# EAGLE design MGBC-LIPO_1-3 (EAGLE 9.6.2)
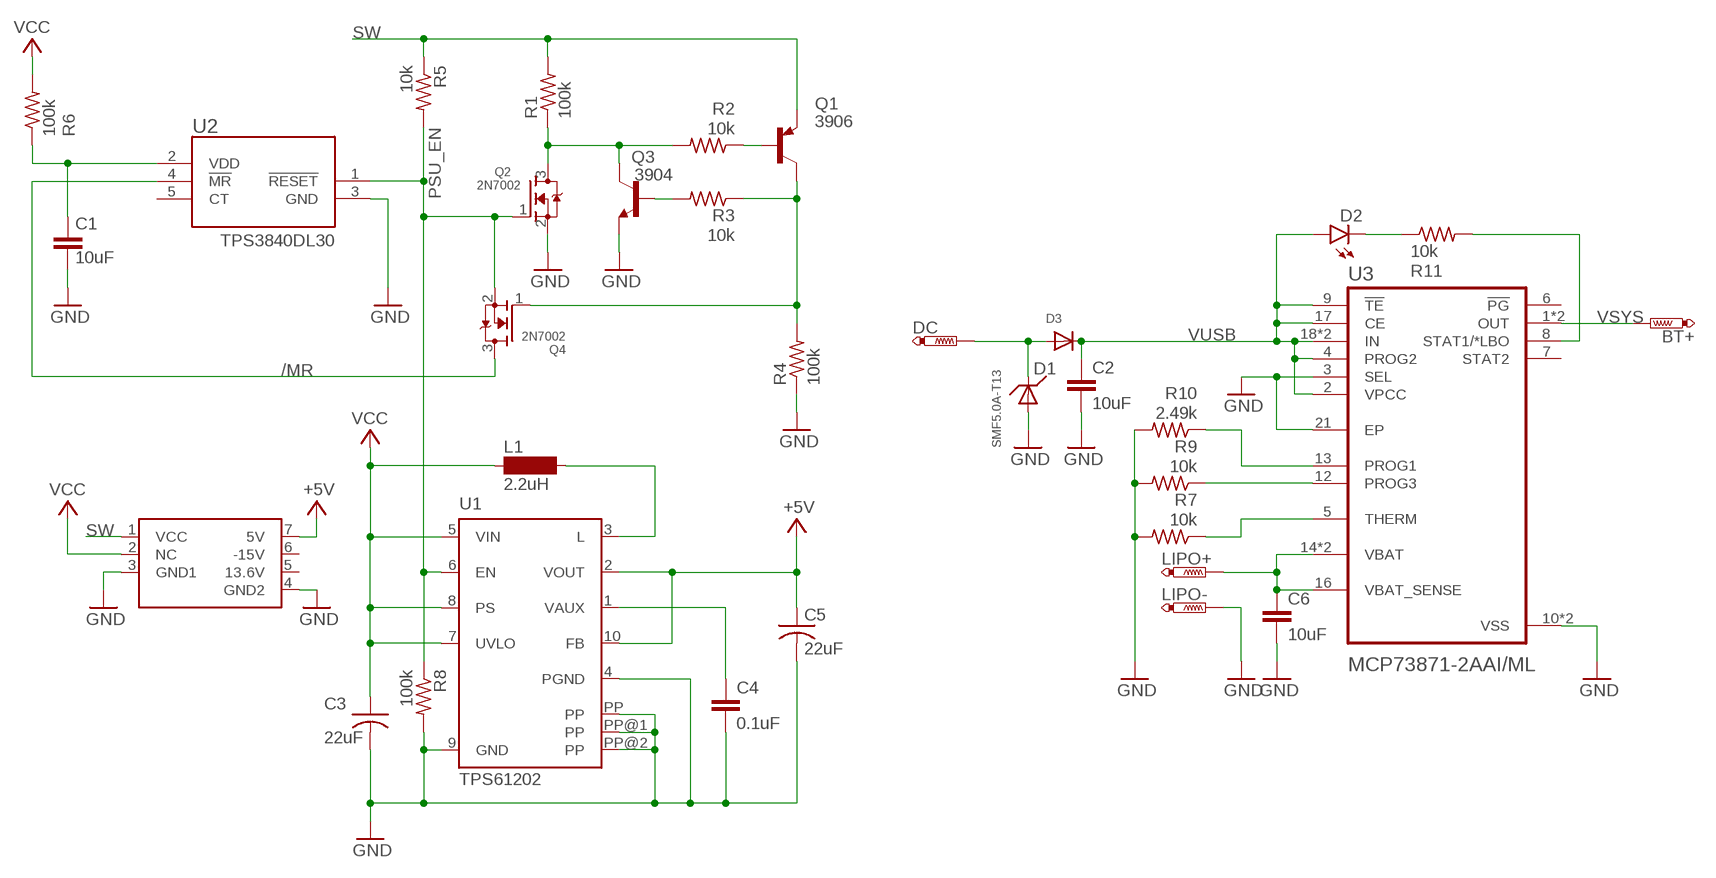
[diagram p0: schematic, sheet 1]

## Parts
BT+  PTR1SLIM  [P1-13S]
C1  10uF  C-EUC0805  [C0805]
C2  10uF  C-EUC0603  [C0603]
C3  22uF  C-USC0805  [C0805]
C4  0.1uF  C-EUC0603  [C0603]
C5  22uF  C-USC0805  [C0805]
C6  10uF  C-EUC0603  [C0603]
D1  SMF5.0A-T13  DIODESOD-123  [SOD-123]
D2  LEDSML0603  [SML0603]
D3  DIODESMA  [SMADIODE]
DC  PTR1SLIM  [P1-13S]
L1  2.2uH  LQH3NPN2R2  [1212]
LIPO+  PTR1SLIM  [P1-13S]
LIPO-  PTR1SLIM  [P1-13S]
Q1  MMBT3906LT1SMD  [SOT23-BEC]
Q2  2N7002  MOSFET-NREFLOW  [SOT23]
Q3  3904  MMBT3904LT1-NPN-SOT23-BEC  [SOT23-BEC]
Q4  2N7002  MOSFET-NREFLOW  [SOT23]
R1  100k  R-US_R0603  [R0603]
R2  10k  R-US_R0603  [R0603]
R3  10k  R-US_R0603  [R0603]
R4  100k  R-US_R0603  [R0603]
R5  10k  R-US_R0603  [R0603]
R6  100k  R-US_R0603  [R0603]
R7  10k  R-US_R0603  [R0603]
R8  100k  R-US_R0603  [R0603]
R9  10k  R-US_R0603  [R0603]
R10  2.49k  R-US_R0603  [R0603]
R11  10k  R-US_R0603  [R0603]
U1  TPS61202  [S-PDSO-N10]
U2  TPS3840  [SOT-23-5]
U3  MCP73871-2AAI/ML  [QFN50P400X400X100-21N]
U$1  MGB-PWR_BD  [MGB-PWRBD]

## Nets
+5V: C5.1 U1.2(VOUT) U1.10(FB) U$1.7(5V)
/MR: Q4.3(D) U2.4(!MR)
GND: C1.2 C2.2 C3.2 C4.2 C5.2 C6.2 D1.A LIPO-.TP Q2.2(S) Q3.E R4.1 R7.2 R8.2 R9.2 R10.2 U1.4(PGND) U1.9(GND) U1.PP U1.PP@1(PP) U1.PP@2(PP) U2.3(GND) U3.3(SEL) U3.10(VSS) U3.11(VSS) U3.21(EP) U$1.3(GND1) U$1.4(GND2)
L: L1.2 U1.3(L)
N$1: C1.1 R6.1 U2.2(VDD)
N$2: D1.C D3.A DC.TP
N$5: R11.2 U3.8(STAT1/*LBO)
N$6: R7.1 U3.5(THERM)
N$7: R10.1 U3.13(PROG1)
N$8: R9.1 U3.12(PROG3)
N$9: D2.C R11.1
N$10: Q1.B R2.1
N$12: Q1.C Q4.1(G) R3.1 R4.2
N$13: Q3.B R3.2
N$14: Q2.3(D) Q3.C R1.1 R2.2
N$34: C4.1 U1.1(VAUX)
PSU_EN: Q2.1(G) Q4.2(S) R5.2 R8.1 U1.6(EN) U2.1(!RESET)
SW: Q1.E R1.2 R5.1 U$1.1(VCC)
V_POS: C6.1 LIPO+.TP U3.14(VBAT) U3.15(VBAT) U3.16(VBAT_SENSE)
VCC: C3.1 L1.1 R6.2 U1.5(VIN) U1.7(UVLO) U1.8(PS) U$1.2(NC)
VSYS: BT+.TP U3.1(OUT) U3.20(OUT)
VUSB: C2.1 D2.A D3.C U3.2(VPCC) U3.4(PROG2) U3.9(!TE) U3.17(CE) U3.18(IN) U3.19(IN)
Unconnected: U2.5(CT) U3.6(!PG) U3.7(STAT2)

## Notes on the sheet
- 3906
- TPS3840DL30

## Power pins joined to a net without a drawn wire
13.6V: U$1.5(13.6V)
-15V: U$1.6(-15V)

## Library data of the parts
BT+ DC LIPO+ LIPO- = testpad:PTR1: TEST PIN
C1 C2 C4 C6 = rcl:C-EU: CAPACITOR, European symbol; SPICEPREFIX: C
C3 C5 = rcl:C-US: CAPACITOR, American symbol; SPICEPREFIX: C
D1 D3 = adafruit:DIODE: Diode SMADIODE - SMA Surface Mount Package 20V 1A Schottky Diode Digikey: 641-1014-6-ND DO-1N4148 - Through Hole Small Current Diode SOD-123 20V 1 A (.5mV Vf) Schottky Diode - Digikey: MBRX120TPMSCT-ND SOD-323 10V 570mA (.38mV Vf, 3ns) Schottky Diode - Digikey: ZLLS410CT-ND SOD-523 30V 30mA Schottky Diode (RB751S-40TE61) - Digikey: RB751S-40TE61CT-ND SOT23-R/W - SOT23 Package (R = Solder Paste/Reflow Ovens, W = Hand-Soldering) BAT54Film 40V 300mA - Digikey: 497-7162-1-ND
D2 = led:LED: LED OSRAM: - CHIPLED LG R971, LG N971, LY N971, LG Q971, LY Q971, LO R971, LY R971 LH N974, LH R974 LS Q976, LO Q976, LY Q976 LO Q996 - Hyper CHIPLED LW Q18S LB Q993, LB Q99A, LB R99A - SideLED LS A670, LO A670, LY A670, LG A670, LP A670 LB A673, LV A673, LT A673, LW A673 LH A674 LY A675 LS A676, LA A676, LO A676, LY A676, LW A676 LS A679, LY A679, LG A679 - Hyper Micro SIDELED® LS Y876, LA Y876, LO Y876, LY Y876 LT Y87S - SmartLED LW L88C, LW L88S LB L89C, LB L89S, LG L890 LS L89K, LO L89K, LY L89K LS L896, LA L896, LO L896, LY L896 - TOPLED LS T670, LO T670, LY T670, LG T670, LP T670 LSG T670, LSP T670, LSY T670, LOP T670, LYG T670 LG T671, LOG T671, LSG T671 LB T673, LV T673, LT T673, LW T673 LH T674 LS T676, LA T676, LO T676, LY T676, LB T676, LH T676, LSB T676, LW T676 LB T67C, LV T67C, LT T67C, LS T67K, LO T67K, LY T67K, LW E67C LS E67B, LA E67B, LO E67B, LY E67B, LB E67C, LV E67C, LT E67C LW T67C LS T679, LY T679, LG T679 LS T770, LO T770, LY T770, LG T770, LP T770 LB T773, LV T773, LT T773, LW T773 LH T774 LS E675, LA E675, LY E675, LS T675 LS T776, LA T776, LO T776, LY T776, LB T776 LHGB T686 LT T68C, LB T68C - Hyper Mini TOPLED® LB M676 - Mini TOPLED Santana® LG M470 LS M47K, LO M47K, LY M47K Source: http://www.osram.convergy.de LUXEON: - LUMILED® LXK2-PW12-R00, LXK2-PW12-S00, LXK2-PW14-U00, LXK2-PW14-V00 LXK2-PM12-R00, LXK2-PM12-S00, LXK2-PM14-U00 LXK2-PE12-Q00, LXK2-PE12-R00, LXK2-PE12-S00, LXK2-PE14-T00, LXK2-PE14-U00 LXK2-PB12-K00, LXK2-PB12-L00, LXK2-PB12-M00, LXK2-PB14-N00, LXK2-PB14-P00, LXK2-PB14-Q00 LXK2-PR12-L00, LXK2-PR12-M00, LXK2-PR14-Q00, LXK2-PR14-R00 LXK2-PD12-Q00, LXK2-PD12-R00, LXK2-PD12-S00 LXK2-PH12-R00, LXK2-PH12-S00 LXK2-PL12-P00, LXK2-PL12-Q00, LXK2-PL12-R00 Source: www.luxeon.com KINGBRIGHT: KA-3528ASYC Source: www.kingbright.com
L1 = gameboy:LQH3NPN2R2: INDUCTOR SMD power inductor; OC_FARNELL: unknown; OC_NEWARK: unknown
Q1 = transistor-pnp:MMBT3906*: PNP Transistror
Q2 Q4 = adafruit:MOSFET-N: N-Channel Mosfet 2N7002E - 60V 260mA SOT23 [Digikey: 2N7002ET1GOSTR-ND] - REEL BSH103 - 30V 850mA SOT23 [Digikey: 568-5013-1-ND]
Q3 = transistor-neu-to92:*-NPN-: NPN Transistror
R1-R11 = rcl:R-US_: RESISTOR, American symbol; SPICEPREFIX: R
U1 = texas:TPS6120*: LOW INPUT VOLTAGE SYNCHRONOUS BOOST CONVERTER WITH 1.3-A SWITCHES Source: http://focus.ti.com/lit/ds/symlink/tps61200.pdf; MPN: TPS61202DRCR; OC_FARNELL: unknown; OC_NEWARK: 37M0069
U2 = SOT95P280X145-5N:TPS3840
U3 = MCP73871-2AAI_ML:MCP73871-2AAI/ML; DESCRIPTION: Charger IC Lithium Ion/Polymer 20-QFN (4x4); DIGI-KEY_PART_NUMBER: MCP73871-2AAI/ML-ND; MF: Microchip Technology; MP: MCP73871-2AAI/ML; PACKAGE: QFN-20 Microchip Technology; PURCHASE-URL: https://pricing.snapeda.com/search/part/MCP73871-2AAI/ML/?ref=eda
U$1 = Game Boy:MGB-PWR_BD

## Board
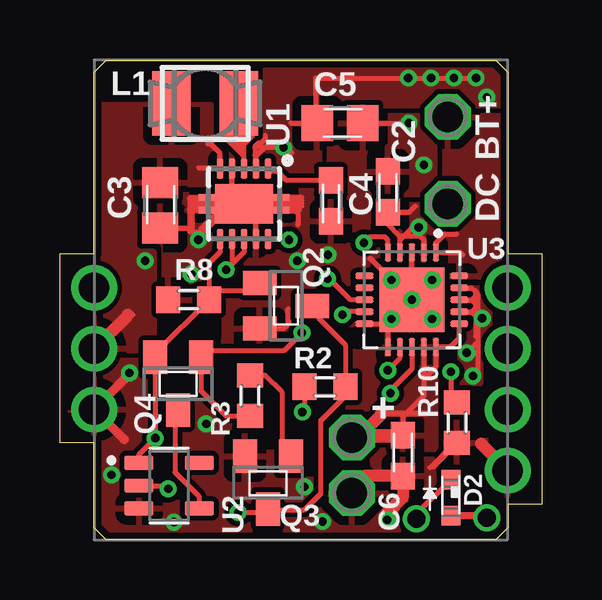
[diagram p1: board, top side]
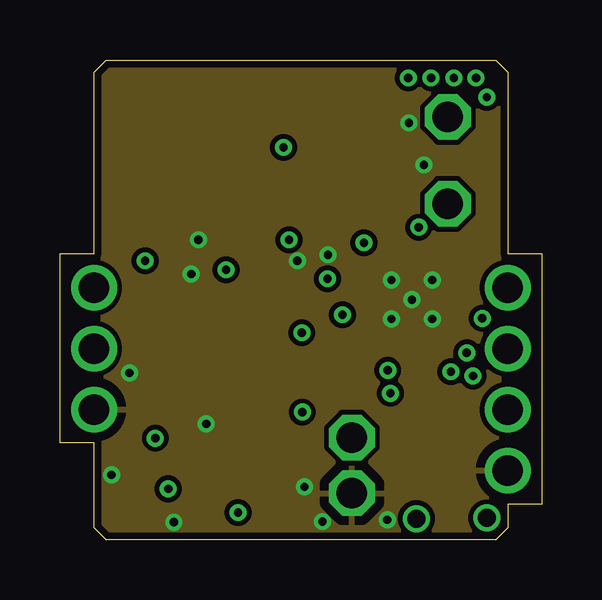
[diagram p2: board, inner layer Route2]
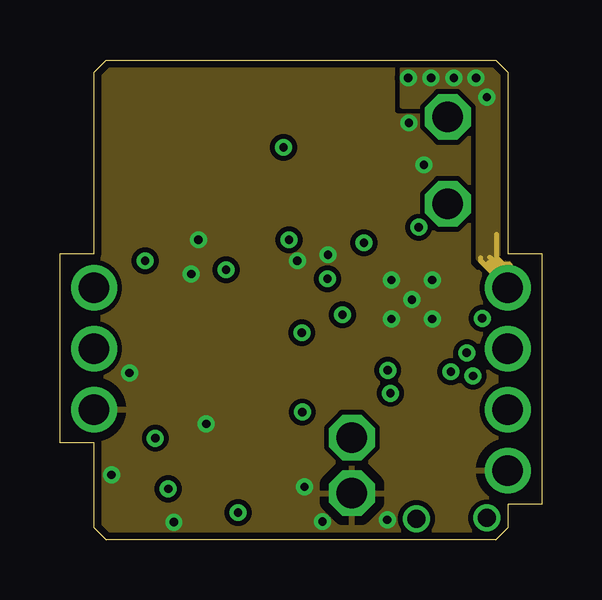
[diagram p3: board, inner layer Route15]
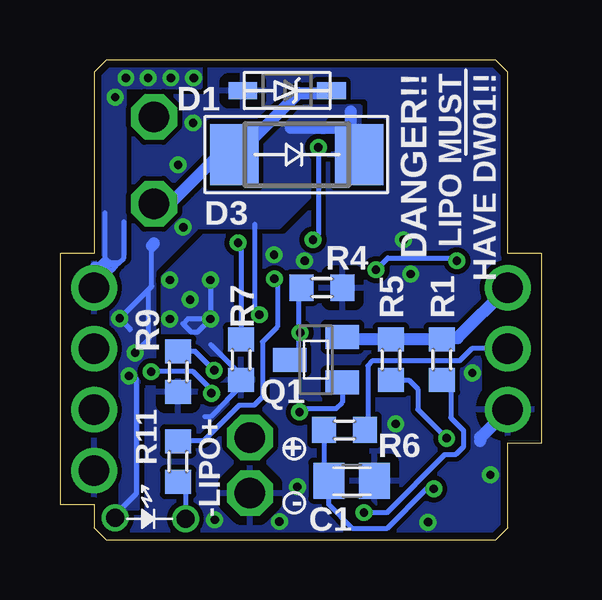
[diagram p4: board, bottom side, seen from below]

Size 20.1 x 20 mm. Coordinates in mm from the lower left corner, seen from the top.
Outline: 1.43,0.5 1.43,4.04 0,4.04 0,11.93 1.43,11.93 1.43,19.5 1.93,20 18.18,20 18.68,19.5 18.68,11.93 20.1,11.93 20.1,1.48 18.68,1.48 18.68,0.5 18.18,0 1.93,0 1.43,0.5
Copper layers (1+2*15+16): Top 0.0356mm / dielectric 1.5011mm / Route2 0.0356mm / dielectric 0.1499mm / Route15 0.0356mm / dielectric 0.2007mm / Bottom 0.0356mm
Design rules "jlcpcb *": minimum track width 8mil, minimum drill 13mil, track to track 8mil, track to pad 8mil, pad to pad 8mil, via to via 8mil, smd to smd 5mil, copper to edge 12mil, drill to drill 22mil, minimum pad ring 7mil, minimum via ring 7mil, stop-mask expansion 2.5mil, vias tented up to drill 14mil, thermal gap 15mil
tRestrict: area 0.1,5.8 to 1.1,9.8; area 19.3,2.8 to 20.6,10.3; area 12.4,8.2 to 13.2,8.6; area 18.2,4.1 to 18.7,5.1; area 17.3,4.5 to 18.3,5.1; area 16.9,1.9 to 17.9,2.8; area 10.3,2.9 to 10.6,3.9; area 8.7,4 to 8.9,5; area 4.4,8.8 to 4.5,9.2; area 6.3,8.4 to 6.4,9.1; area 13.3,9.6 to 13.5,10.4; area 15.9,9.6 to 16.1,10.4; 1 more areas
bRestrict: area 0.7,6 to 2.2,8; area 19.3,2.8 to 20.6,10.3; area 7.5,3.5 to 7.9,4

### Footprints (pad centres in the part's own frame; a part is rotated, then mirrored left to right if it is on the bottom)
P1-13S = drill 1.27 pad 1.905 octagon: TP 0,0
C0805 = smd 1.3 x 1.5: 1 -0.95,0; 2 0.95,0
C0603 = smd 1.1 x 1: 1 -0.85,0; 2 0.85,0
SOD-123 = smd 1.2 x 0.7: A 1.85,0; C -1.85,0
SML0603 = smd 0.8 x 0.8: A 0.75,0; C -0.75,0
SMADIODE = smd 2.032 x 2.54: A 2.603,0; C -2.603,0
1212 = smd 1.6 x 2.7: 1 1.4,0; 2 -1.4,0
SOT23-BEC = smd 1 x 1.4: B -0.95,-1.1; C 0,1.1; E 0.95,-1.1
SOT23 = smd 1 x 1.4: 1 -0.95,-1.1; 2 0.95,-1.1; 3 0,1.1
R0603 = smd 1 x 1.1: 1 -0.85,0; 2 0.85,0
S-PDSO-N10 = smd 0.28 x 0.85: 1 -1,-1.475; 2 -0.5,-1.475; 3 0,-1.475; 4 0.5,-1.475; 5 1,-1.475; 6 1,1.475; 7 0.5,1.475; 8 0,1.475; 9 -0.5,1.475; 10 -1,1.475 | smd 2.4 x 1.65: PP 0,0 | smd 3.8 x 0.28: PP@1 0,0.275; PP@2 0,-0.275
SOT-23-5 = smd 1.21 x 0.59: 1 -1.255,0.95; 2 -1.255,0; 3 -1.255,-0.95; 4 1.255,-0.95; 5 1.255,0.95
QFN50P400X400X100-21N = smd 0.76 x 0.26: 1 -1.975,1; 2 -1.975,0.5; 3 -1.975,0; 4 -1.975,-0.5; 5 -1.975,-1; 11 1.975,-1; 12 1.975,-0.5; 13 1.975,0; 14 1.975,0.5; 15 1.975,1 | smd 0.26 x 0.76: 6 -1,-1.975; 7 -0.5,-1.975; 8 0,-1.975; 9 0.5,-1.975; 10 1,-1.975; 16 1,1.975; 17 0.5,1.975; 18 0,1.975; 19 -0.5,1.975; 20 -1,1.975 | smd 2.7 x 2.7: 21 0,0
MGB-PWRBD = drill 1.27: 1 -0.25,10.5; 2 -0.25,7.96; 3 -0.25,5.42; 4 17,2.88; 5 17,5.42; 6 17,7.96; 7 17,10.5

### Placement (x,y rotation side)
BT+  16.18,17.62 0 top
C1  7.94,2.45 0 bottom
C2  13.68,14.5 90 top
C3  4.17,13.94 270 top
C4  11.3,14.12 270 top
C5  11.68,17.38 0 top
C6  14.3,3.5 270 top
D1  10.62,18.73 180 bottom
D2  16.3,1.75 270 top
D3  10.23,16.05 180 bottom
DC  16.18,14 0 top
L1  6.05,18.19 180 top
LIPO+  12.18,4.25 0 top
LIPO-  12.18,1.94 180 top
Q1  9.43,7.5 90 bottom
Q2  9.43,9.75 270 top
Q3  8.68,2.38 180 top
Q4  4.92,6.5 180 top
R1  4.17,7.5 90 bottom
R2  11.05,6.38 0 top
R3  7.92,6 90 top
R4  9.18,10.5 180 bottom
R5  6.3,7.5 270 bottom
R6  10k  [R0603]  8.24,4.58 0 bottom
R7  12.55,7.5 270 bottom
R8  5.36,10 180 top
R9  15.18,7 270 bottom
R10  16.55,4.88 270 top
R11  15.18,3.25 90 bottom
U1  7.67,14 180 top
U2  4.55,2.25 0 top
U3  14.68,10 270 top
U$1  1.68,0 0 top

### Tracks (layer width: path | path; a pad name or v marks a point on that pad's centre or on a via)
+5V  (via drill 0.35)
  Top 0.203: 9.62,17.38 C5.1 10.68,17.43 10.68,19.25 v17.35,19.25 | U1.2 8.18,16 | 8.18,16 8.55,16.38 8.68,16.38 | 8.18,16 8.12,16.05 8.12,16.38 8.28,16.53 8.38,16.53 | 8.55,16.85 8.55,16.71 8.38,16.53 | 8.38,16.53 8.36,16.52 8.36,16.36 v9.33,16.36 9.45,16.36 9.68,16.12 | U1.10 9.53,12.53 v9.55,12.5
  Route15 0.203: U$1.7 17.55,11.62 17.55,11.75 | 18.22,12.72 18.22,11.74 18.49,11.47 18.78,11.47 18.78,11.03 18.73,10.97 | U$1.7 18.68,10.93 18.73,10.97 | U$1.7 18.68,10.75 17.88,11.55 | 18.73,10.97 17.93,11.78
  Bottom 0.203: v9.33,16.36 9.33,12.72 v9.55,12.5 | 18.06,11.12 17.85,11.32 | 17.85,11.32 17.65,11.53 | 17.65,11.53 17.43,11.75 17.43,13.25 | 18.61,10.56 18.22,10.96 | 18.22,10.96 18.22,11.3 | 18.22,11.3 18.22,11.72 | 18.22,11.72 18.22,11.75 | 18.22,11.75 18.22,13.62 | 18.22,11.75 17.99,11.53 | 17.65,11.53 17.99,11.53 | 18.06,11.46 17.99,11.53 | 18.06,11.46 18.22,11.3 | U$1.7 18.61,10.56 | 18.22,10.96 18.06,11.12 | 18.06,11.12 18.06,11.46 | 17.99,11.53 17.85,11.38 17.85,11.32 | 18.22,11.72 18.41,11.53 18.41,11.46 | 18.38,11.33 18.51,11.21 | 18.61,10.56 18.61,11.23 18.51,11.33 18.51,11.21 | U$1.7 18.51,10.67 18.51,11.21 | U$1.7 18.38,10.79 18.38,11.33 | 18.38,11.33 18.38,11.46 18.41,11.46 | 18.41,11.46 18.42,11.47 18.73,11.47
  other vias: 16.43,19.25 15.48,19.25 17.8,18.45 14.53,19.25
  pour Top (isolate 0.203, rank 2): 7.67,15.12 7.67,20 20.18,20 20.18,18.07 10.83,18.07 10.83,15.38 8.43,15.38 8.18,15.12
  pour Bottom (isolate 0.203, rank 2): 17.43,9.5 20.43,9.5 20.43,20.25 14.25,20.25 14.25,18.88 17.43,18.88
  pour Route15 (isolate 0.203, rank 2): 14.25,19.57 14.25,18.07 17.4,18.07 17.43,18.05 17.43,17.6 17.43,14.57 17.43,11.75 18.68,10.5 18.95,10.5 18.95,20.23 18.93,20.25 14.9,20.25 14.25,19.6
/MR
  Top 0.203: Q4.3 4.8,5.28 4.8,2.81 5.8,1.8 U2.4
GND  (via drill 0.35)
  Top 0.203: U1.4 7.17,14.12 7.02,13.97 | U1.9 8.18,13.88 | U3.10 14.08,9 | 14.08,9 14.3,9 | 7.05,14 6.92,14.12 | 5.4,13.75 5.4,14.22 5.42,14.25 7.42,14.25 7.55,14.12 6.92,14.12 | 5.4,13.75 5.4,13 | 5.4,13 5.4,12.85 6,12.85 | 5.4,13.75 5.53,13.75 | 5.53,13.75 6.8,13.75 7.02,13.97 | C3.2 5.39,12.99 5.4,13 | 6,12.85 6.02,12.85 | 7.02,13.85 7.02,13.97 | U1.PP@1 6.88,13.72 6,12.85 | 6.92,14.12 5.55,14.12 | 5.55,13.88 7.55,13.88 U1.PP | 6.75,13.85 5.88,12.97 | 5.53,13 5.53,13.75 | 7.05,14 7.33,14.28 10.08,14.28 | 7.05,14 7.33,13.72 9.8,13.72 | 9.8,13.72 9.98,13.72 | 7.95,14.15 10.08,14.15 | 7.95,13.9 10.08,13.9 | 9.8,13.72 9.93,13.6 9.93,13.12 | R10.2 16.45,4.03 15.43,3 | 17.55,4 | 15.58,3.02 16.6,4.05 | C5.2 v14.55,17.38 | Q2.2 9.33,8.8 9.54,9.01 9.54,9.1 9.52,9.12 9.52,9.62 | 2.67,6.67 2.67,7 | 2.67,4.17 2.67,4.12 | U3.21 U3.3 | U3.21 14.65,10 v13.83,10.82 | U3.11 13.68,9.3 13.98,9.3 U3.21 | 10.08,14.03 7.7,14.03 U1.PP | U1.PP 5.55,14 5.53,13.97 5.53,13.75 | U3.21 14.08,9.4 14.08,9 | U3.21 12.96,11.72 12.93,11.72
  Top 0.4: 2.67,6.67 U$1.3 2.67,4.17
  Top 0.5: U$1.4 17.55,4 | LIPO-.TP 12.18,2.15 12.68,2.65 C6.2 14.3,1.77 13.65,1.12 v13.65,0.82
  Bottom 0.203: 14.05,5.12 13.82,5.12 13.12,5.83 12.55,6.4 R7.2 12.44,6.76 13.68,8 | 13.68,8 13.8,8.12 13.68,8 | v13.83,9.2 14.78,9.2 14.98,9 14.63,8.65 14.37,8.65 v13.83,9.2 | v13.83,10.82 v13.83,9.2
  Bottom 0.5: U$1.3 2.58,4.27 2.58,4.1
  other vias: 15.18,15.62 11.18,11.88 9.9,11.62 5.77,12.5 5.47,11.07 6.1,4.83 4.75,0.72 2.15,2.7 10.2,2.2 10.95,0.75 15.53,10.82 15.53,9.2 2.9,6.95 14.68,10.01
  pour Top (isolate 0.203, rank 6): -0.57,20.88 21.43,20.88 21.43,-1.12 -1.2,-1.12 -1.2,20.25
  pour Bottom (isolate 0.203, rank 6): -1.2,20.5 21.05,20.5 21.05,-0.25 -1.2,-0.25
  pour Route2 (isolate 0.203, rank 6): 1.8,21 18.3,21 18.3,-1.12 1.8,-1.12
  pour Route15 (isolate 0.203, rank 6): 1.8,21.12 18.18,21.12 18.18,-0.88 1.8,-0.88
L
  Top 0.203: U1.3 7.67,16 | 7.67,16 7.67,16.25 | 7.67,16.25 7.05,16.88 6.92,16.88 | 7.67,16.25 7.67,16.62 | 7.67,16.62 7.61,16.56 | 7.99,16.81 7.67,16.5 7.61,16.56 | 7.99,16.81 8.05,16.88 8.05,17.12 7.92,17.25 | 7.67,16 6.92,16.75 | L1.2 7.45,17.4 6.92,16.88 | L1.2 7.33,18.06 7.33,17 | 7.33,17 7.33,16.85 7.61,16.56 | 7.67,16.62 7.8,16.75 | 7.8,16.75 7.86,16.81 7.99,16.81 | 7.67,16.62 7.67,16.65 7.33,17 | L1.2 7.45,17.1 7.8,16.75 | 6.92,16.75 6.92,16.88 | 6.92,16.75 6.77,16.9 6.77,17.3
N$1  (via drill 0.35)
  Top 0.203: U2.2 4.38,2.25 v4.51,2.11
  Bottom 0.203: v4.51,2.11 4.81,2.11 6.47,0.46 7.88,0.46 8.89,1.46 C1.1 9.09,2.46 R6.1
N$2
  Bottom 0.5: DC.TP 15.53,14 13.48,16.05 D3.A 12.23,16.05 12.48,16.3 | 13.12,16.95 12.48,16.3 | D1.C 8.88,18.62 10.15,18.62 12.48,16.3
N$5  (via drill 0.35)
  Top 0.203: U3.8 12.12,10 11.24,10.88 v11.16,10.88
  Bottom 0.203: R11.2 15.15,4.12 14.1,4.12 12.63,5.59 12,5.59 11.66,5.94 11.66,8.25 11.03,8.88 11.03,10.75 v11.16,10.88
N$6  (via drill 0.35)
  Top 0.203: U3.5 13.68,12.5 13.55,12.62 12.93,12.62 v12.68,12.38
  Bottom 0.203: v12.68,12.38 12.55,12.25 R7.1
N$7  (via drill 0.35)
  Top 0.203: v16.3,7 16.3,5.97 R10.1 | U3.13 14.68,7.12 13.78,6.22 v13.78,6.1
  Bottom 0.203: v16.3,7 16.27,7.03 14.57,7.03 13.78,6.24 v13.78,6.1 13.78,6.22
N$8  (via drill 0.35)
  Top 0.203: U3.12 14.18,7.56 v13.67,7.06
  Bottom 0.203: v13.67,7.06 14.46,7.85 R9.1
N$9  (via drill 0.75)
  Top 0.203: v14.87,0.88 14.87,1.07 D2.C
  Bottom 0.203: R11.1 14.87,2.09 v14.87,0.88
N$10  (via drill 0.35)
  Top 0.203: R2.1 10.2,5.41 v10.11,5.31
  Bottom 0.203: Q1.B 8.33,5.72 8.58,5.46 9.96,5.46 v10.11,5.31
N$12  (via drill 0.35)
  Top 0.203: R3.1 6.92,5.15 5.88,6.2 Q4.1 6.15,7.88 9.34,7.88 v10.09,8.62
  Bottom 0.203: R4.2 10.15,10.38 10.15,8.62 | Q1.C 10.15,7.88 10.15,8.62 | v10.09,8.62 10.15,8.62
N$13
  Top 0.203: R3.2 8.55,6.85 9.25,6.15 9.25,3.48 Q3.B
N$14  (via drill 0.35)
  Top 0.203: Q2.3 10.8,9.47 10.8,9.22 11.9,8.12 R2.2 11.9,6 10.88,4.97 10.88,1.93 10.2,1.25 8.7,1.25 Q3.C 8.53,1.12 v7.42,1.12
  Bottom 0.203: R1.1 3.8,6.28 3.8,5.08 3.28,4.55 3.28,3.88 3.6,3.55 4.05,3.55 6.47,1.12 v7.42,1.12
N$34
  Top 0.203: U1.1 8.8,15.35 9.08,15.35 9.45,14.97 C4.1
PSU_EN  (via drill 0.35)
  Top 0.203: Q2.1 8,10.38 6.59,10.38 R8.1 | R8.1 3.97,7.76 Q4.2 v3.97,4.22 3.29,3.54 U2.1 | U1.6 6.67,12 6.21,11.54 R8.1
  Bottom 0.203: R5.2 5.55,6.65 5.17,6.28 5.17,5.42 v3.97,4.22
SW
  Bottom 0.5: U$1.1 3.53,8.4 4.17,8.4 R1.2 R5.1 8.22,8.35 Q1.E
V_POS
  Top 0.203: U3.14 15.18,6.71 | 15.18,6.71 15.18,6 14.3,5.12 C6.1 | 15.18,6.71 15.68,7.21 U3.15 16.27,8.03 16.65,8.4 U3.16
  Top 0.25: 15.28,5.25 13.25,5.25
  Top 0.5: C6.1 12.28,4.35 LIPO+.TP 12.43,4.25 13.43,5.25 | 14.12,4.28 12.15,4.28
  pour Top (isolate 0.203): 11.43,4.88 12.8,4.88 14.68,6.75 14.68,9.25 14.93,9.5 15.68,9.5 15.68,3.75 11.43,3.75
VCC  (via drill 0.35)
  Top 0.203: 2.42,14.88 2.44,14.89 | 4.65,18.15 L1.1 | 5.8,15.5 6.65,15.5 U1.5 6.67,16.12 6.3,16.5 6.17,16.5 | U1.8 7.67,12 v6.92,11.25 7.17,11.5 U1.7 | 2.84,9.38 3.05,9.38
  Top 0.5: U$1.2 2.84,9.38
  Bottom 0.203: U$1.2 2.92,7.96 3.42,7.46 7.05,7.46 7.26,7.25 7.26,4.7 R6.2 | v6.92,11.25 6.42,11.75 3.67,11.75 v3.55,11.62
  pour Top (isolate 0.203): 0.18,18.15 6.3,18.15 6.3,16.5 6.67,16.12 6.67,15.12 6.33,14.78 3.55,14.78 3.55,12.38 3.92,12 3.92,7.88 0.18,7.88
VSYS
  Top 0.203: 16.55,12.74 16.05,12.74 15.68,12.37 U3.1 16.7,11.97 16.8,11.88
  pour Top (isolate 0.203, rank 3): 15.33,17.35 15.33,18.75 18.68,18.75 18.68,10.5 16.05,10.5 16.05,16.62
VUSB  (via drill 0.35, 0.75)
  Top 0.203: U3.9 12.73,9.51 11.93,9.51 11.8,9.38 v11.78,9.38 | U3.18 17.18,10 | 17.42,9.76 17.42,9.5 | 17.42,9.5 17.42,9.26 | 17.42,9.26 17.42,9.22 | 17.42,9.22 17.42,8.24 | 17.42,8.24 17.42,7.02 v17.23,6.83 | 17.18,10 17.42,9.76 | U3.19 17.18,10.5 17.34,10.34 | 17.34,10.34 17.42,10.26 17.42,10.24 | 17.42,10.24 17.42,9.76 | U3.2 15.18,12.5 15.02,12.66 14.34,12.66 | 14.17,12.66 14.18,12.65 14.18,12.5 | 14.17,12.66 13.68,13.15 C2.1 14.58,13.65 14.83,13.9 | U3.4 14.18,12.5 | 14.34,12.66 14.18,12.5 | 14.34,12.66 14.17,12.66 | 17.42,9.22 v17.61,9.22 17.34,9.5 17.34,10.34 | 17.42,8.24 v16.96,7.79 | 17.18,10 17.42,10.24 | U3.17 17.18,9.5 | 17.18,9.5 17.34,9.5 | 17.34,9.5 17.42,9.5 | 17.34,9.5 17.34,8.49 | 17.34,10.2 17.34,9.66 | 17.34,9.66 17.34,9.5 | 17.34,9.66 17.18,9.5 | 17.18,9.5 17.42,9.26 | 14.34,12.66 14.86,13.18 14.9,13.18
  Top 0.3: v17.8,0.9 17.7,1 D2.A
  Bottom 0.203: v17.23,6.83 17.05,6.83 16.92,6.69 16.92,1.91 17.8,1.02 v17.8,0.9 | 11.93,9.52 v11.78,9.38 11.98,9.57 11.98,13.15 | 16.4,10.44 v17.61,9.22 17.18,8.79 17.18,8.75 | 16.4,10.44 16.27,10.56 16.27,12.25 | v16.96,7.79 16.4,8.35 16.4,10.44
  Bottom 0.5: 16.18,12.35 16.27,12.25 | 10.48,17.16 8.14,17.16 7.62,16.65 D3.C 7.97,16.4 7.97,17.85
  other vias: 14.96,13.03
  pour Top (isolate 0.203, rank 4): 14.18,14 17.05,14 17.05,11.25 14.18,11.25
  pour Bottom (isolate 0.203): 14.43,14 14.43,13 16.2,11.22 16.2,6.6 16.88,6.6 16.88,1.3 17.48,1.3 17.55,1.38 17.55,7.5 17.93,7.88 17.93,10.75 17.02,11.65 17.02,13.78 16.8,14
  pour Top (isolate 0.203, rank 5): 16.68,10.62 17.93,10.62 17.93,8.12 17.55,8.12 17.55,6.5 16.68,6.5
  pour Bottom: 15.18,12.25 14.38,13.05 10.98,13.05 8.97,15.05 7.58,15.05 7.58,18.05 10.88,18.05 15.33,13.6 15.33,12.35 15.23,12.25

### Text on the board
tPlace: +
bPlace: LIPO MUST / HAVE DW01!! | DANGER!! | + | - | -LIPO+
bStop: v1.3